# EAGLE schematic C64 (EAGLE 8.1.1)
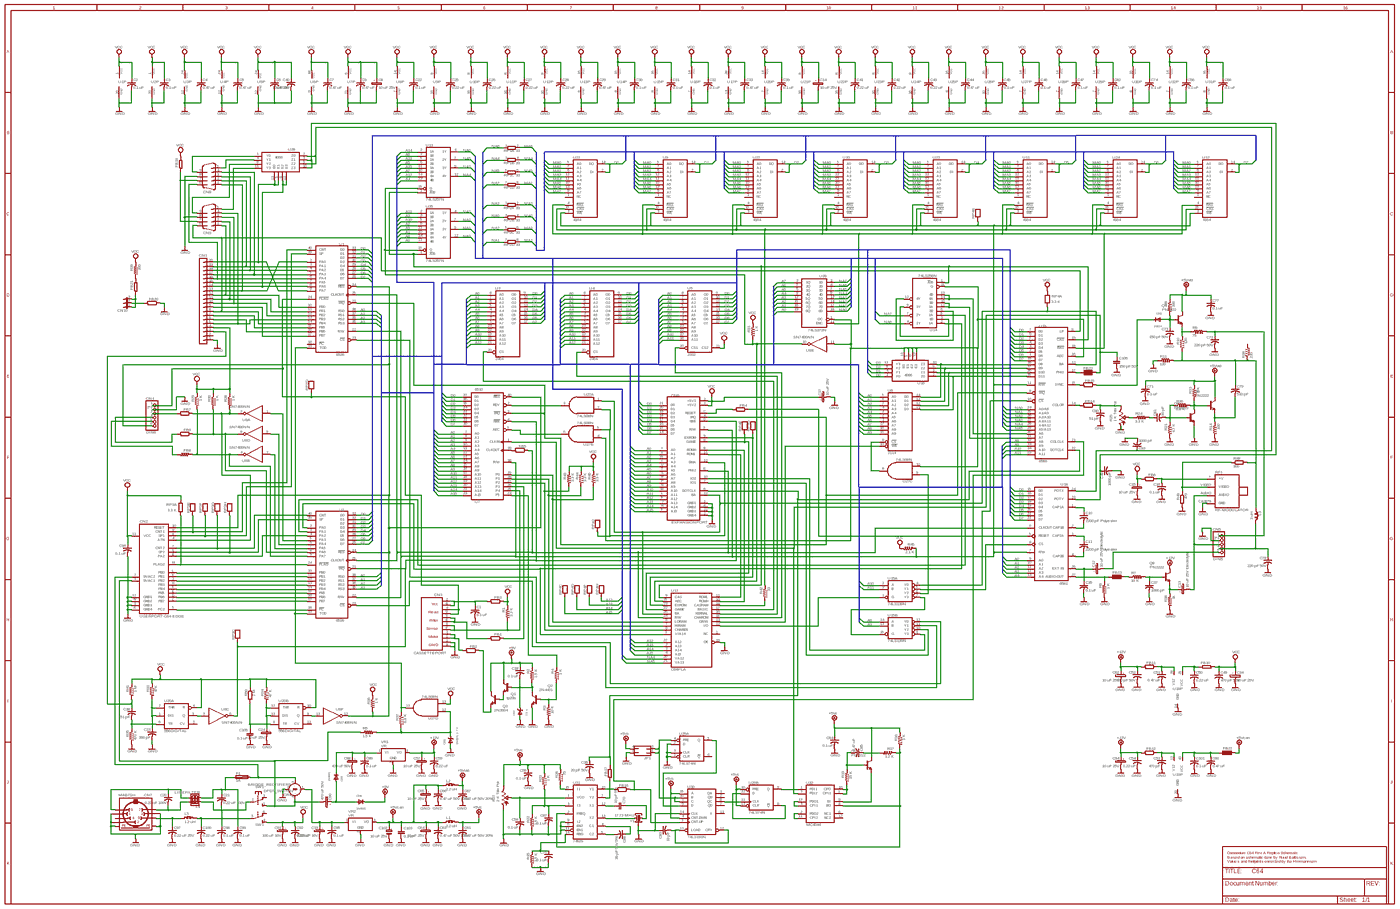
[diagram p0: schematic, sheet 1, overview]
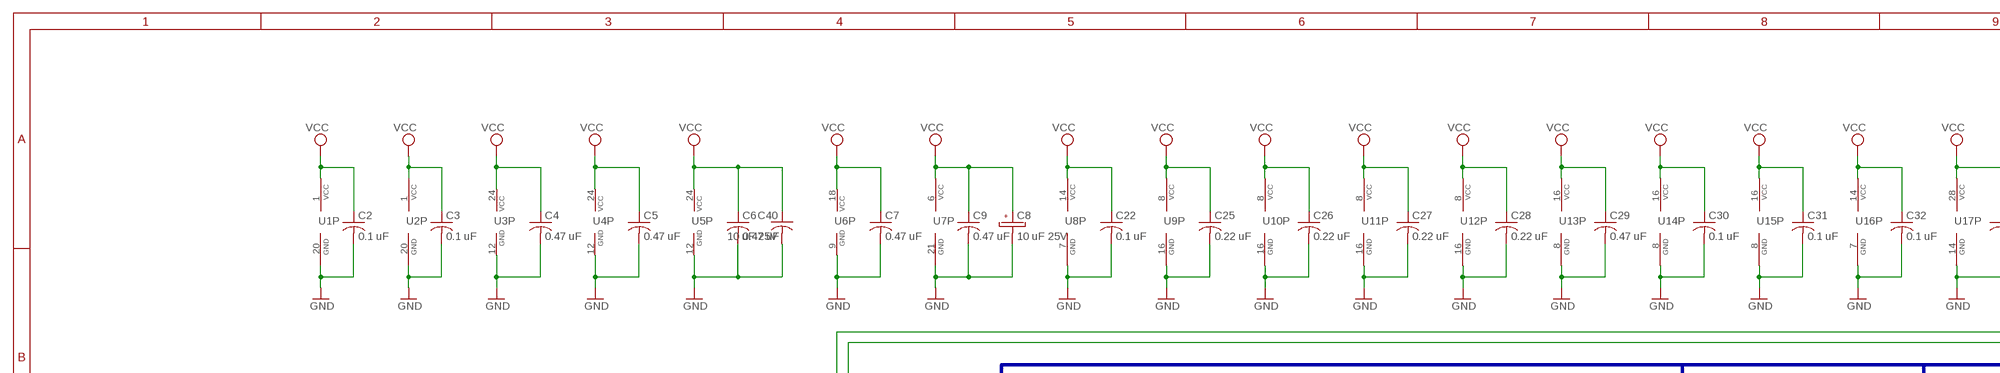
[diagram p1: schematic, sheet 1, part 1 of 4]
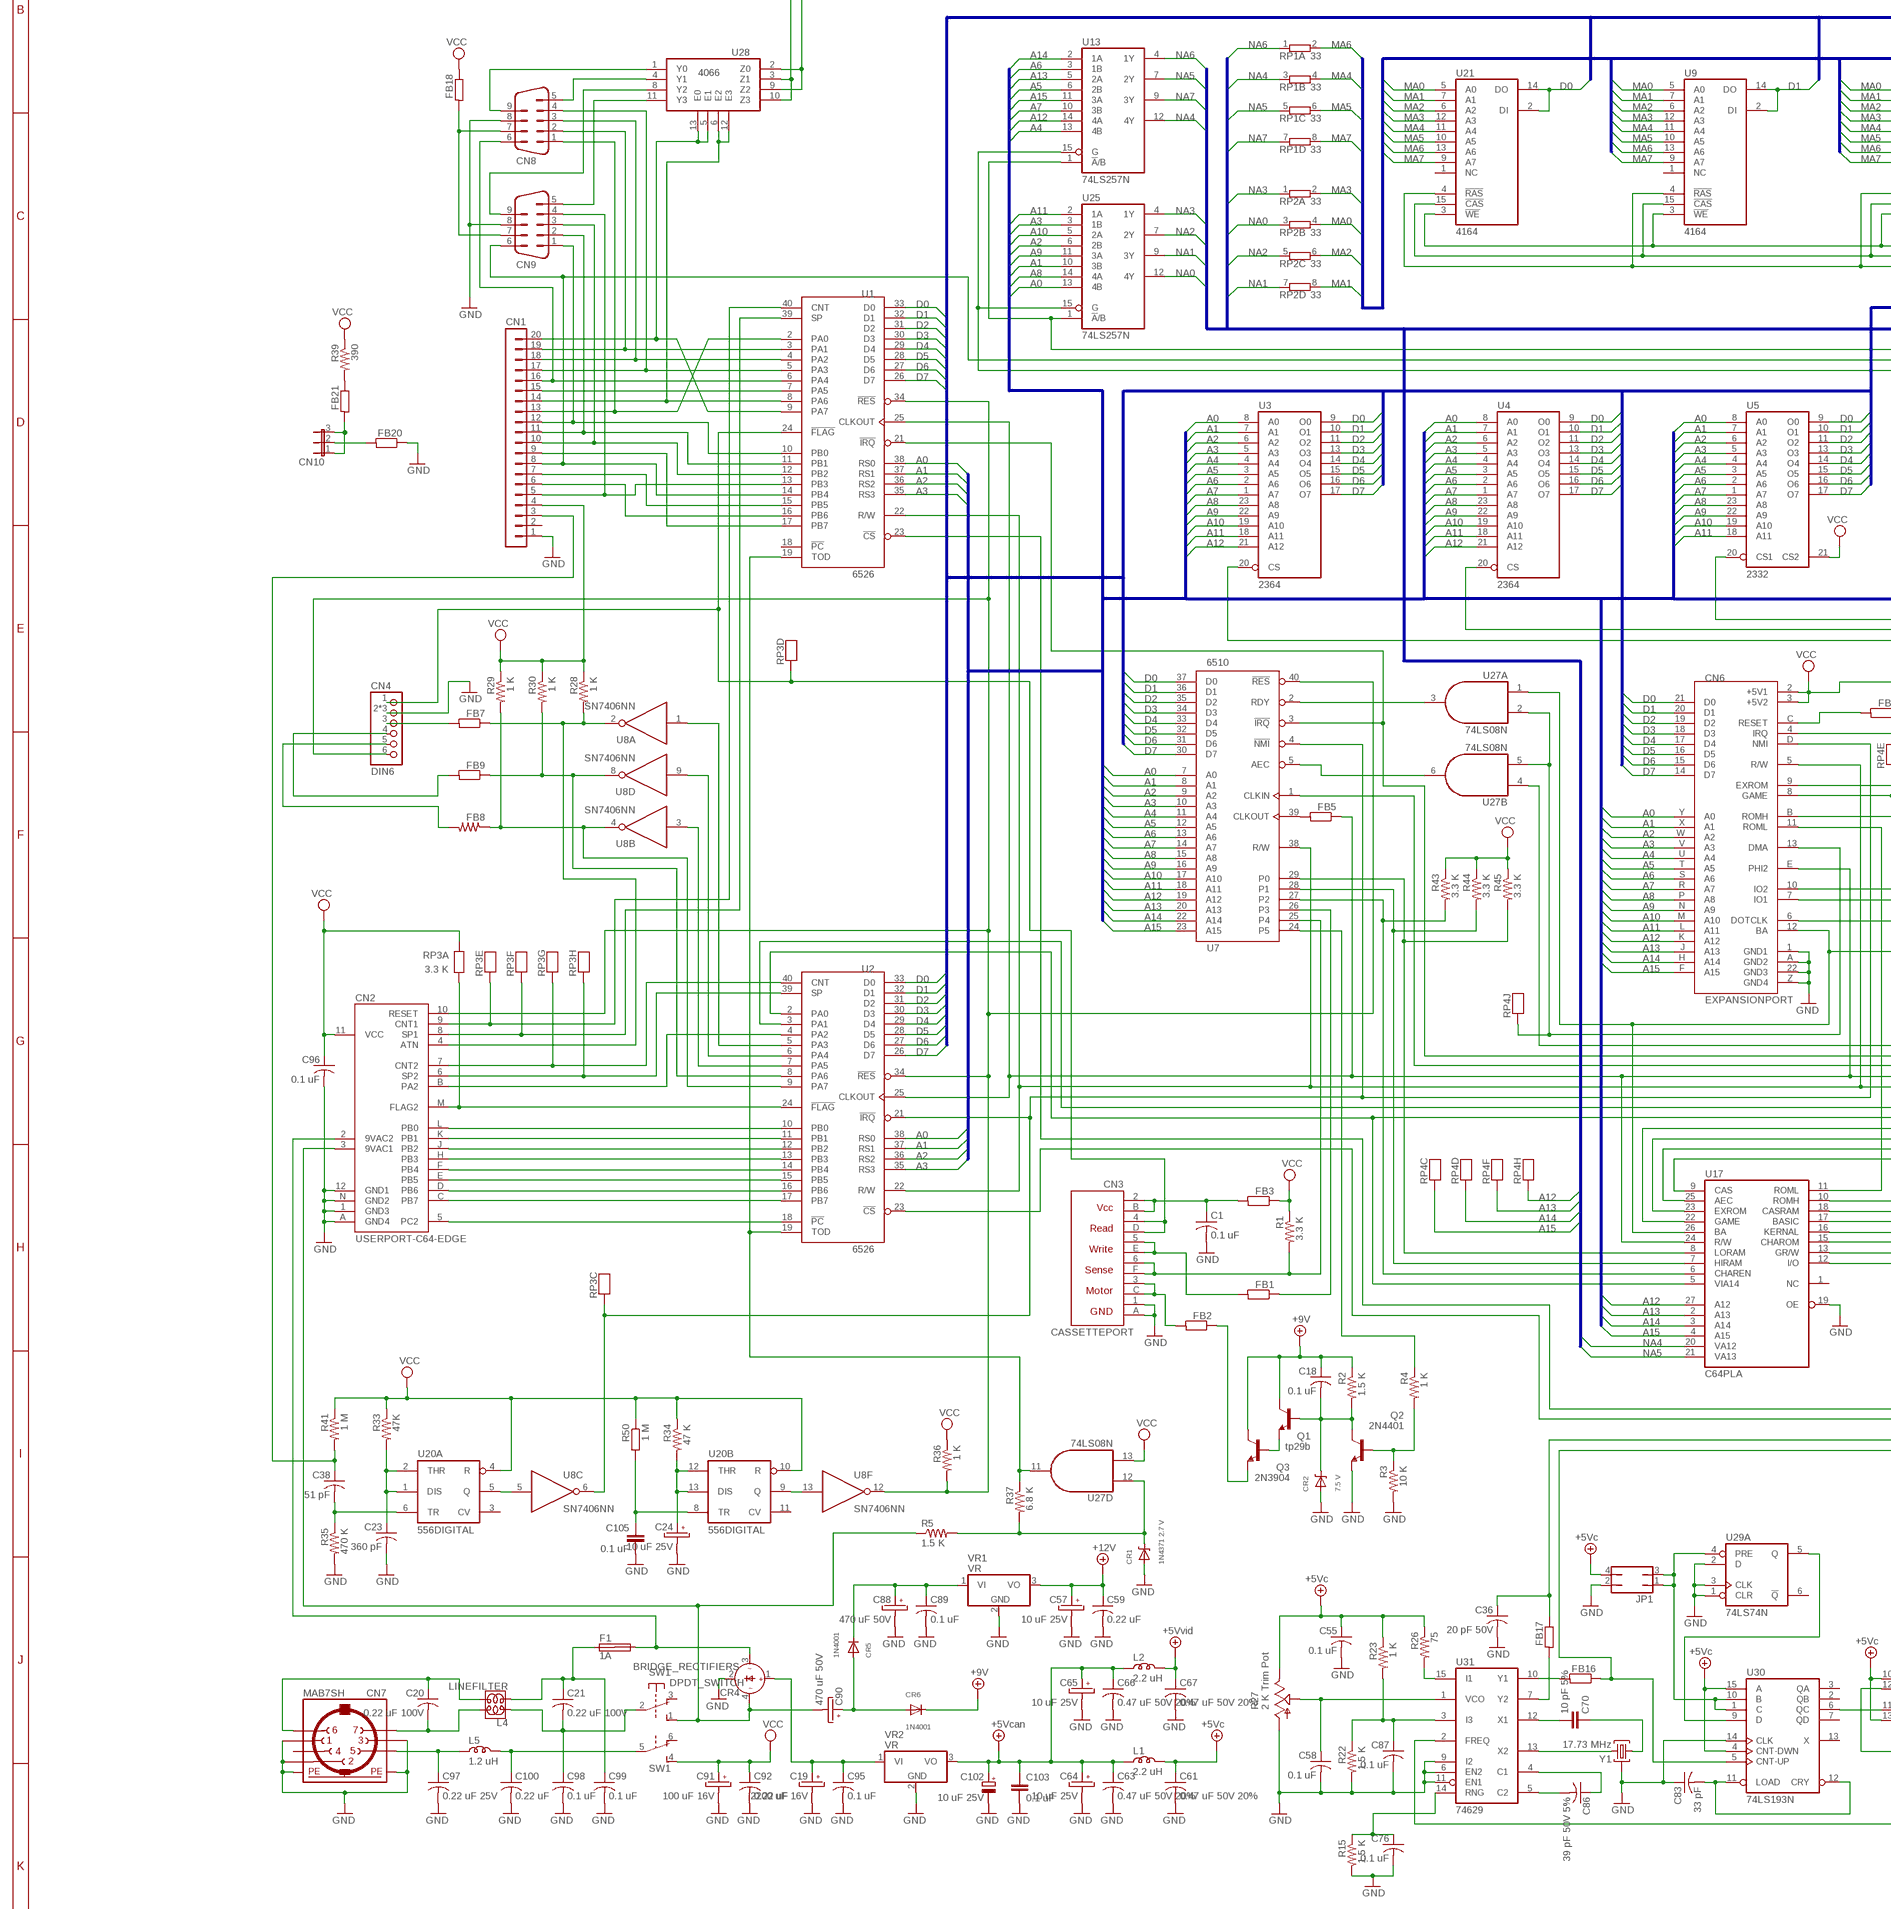
[diagram p2: schematic, sheet 1, part 2 of 4]
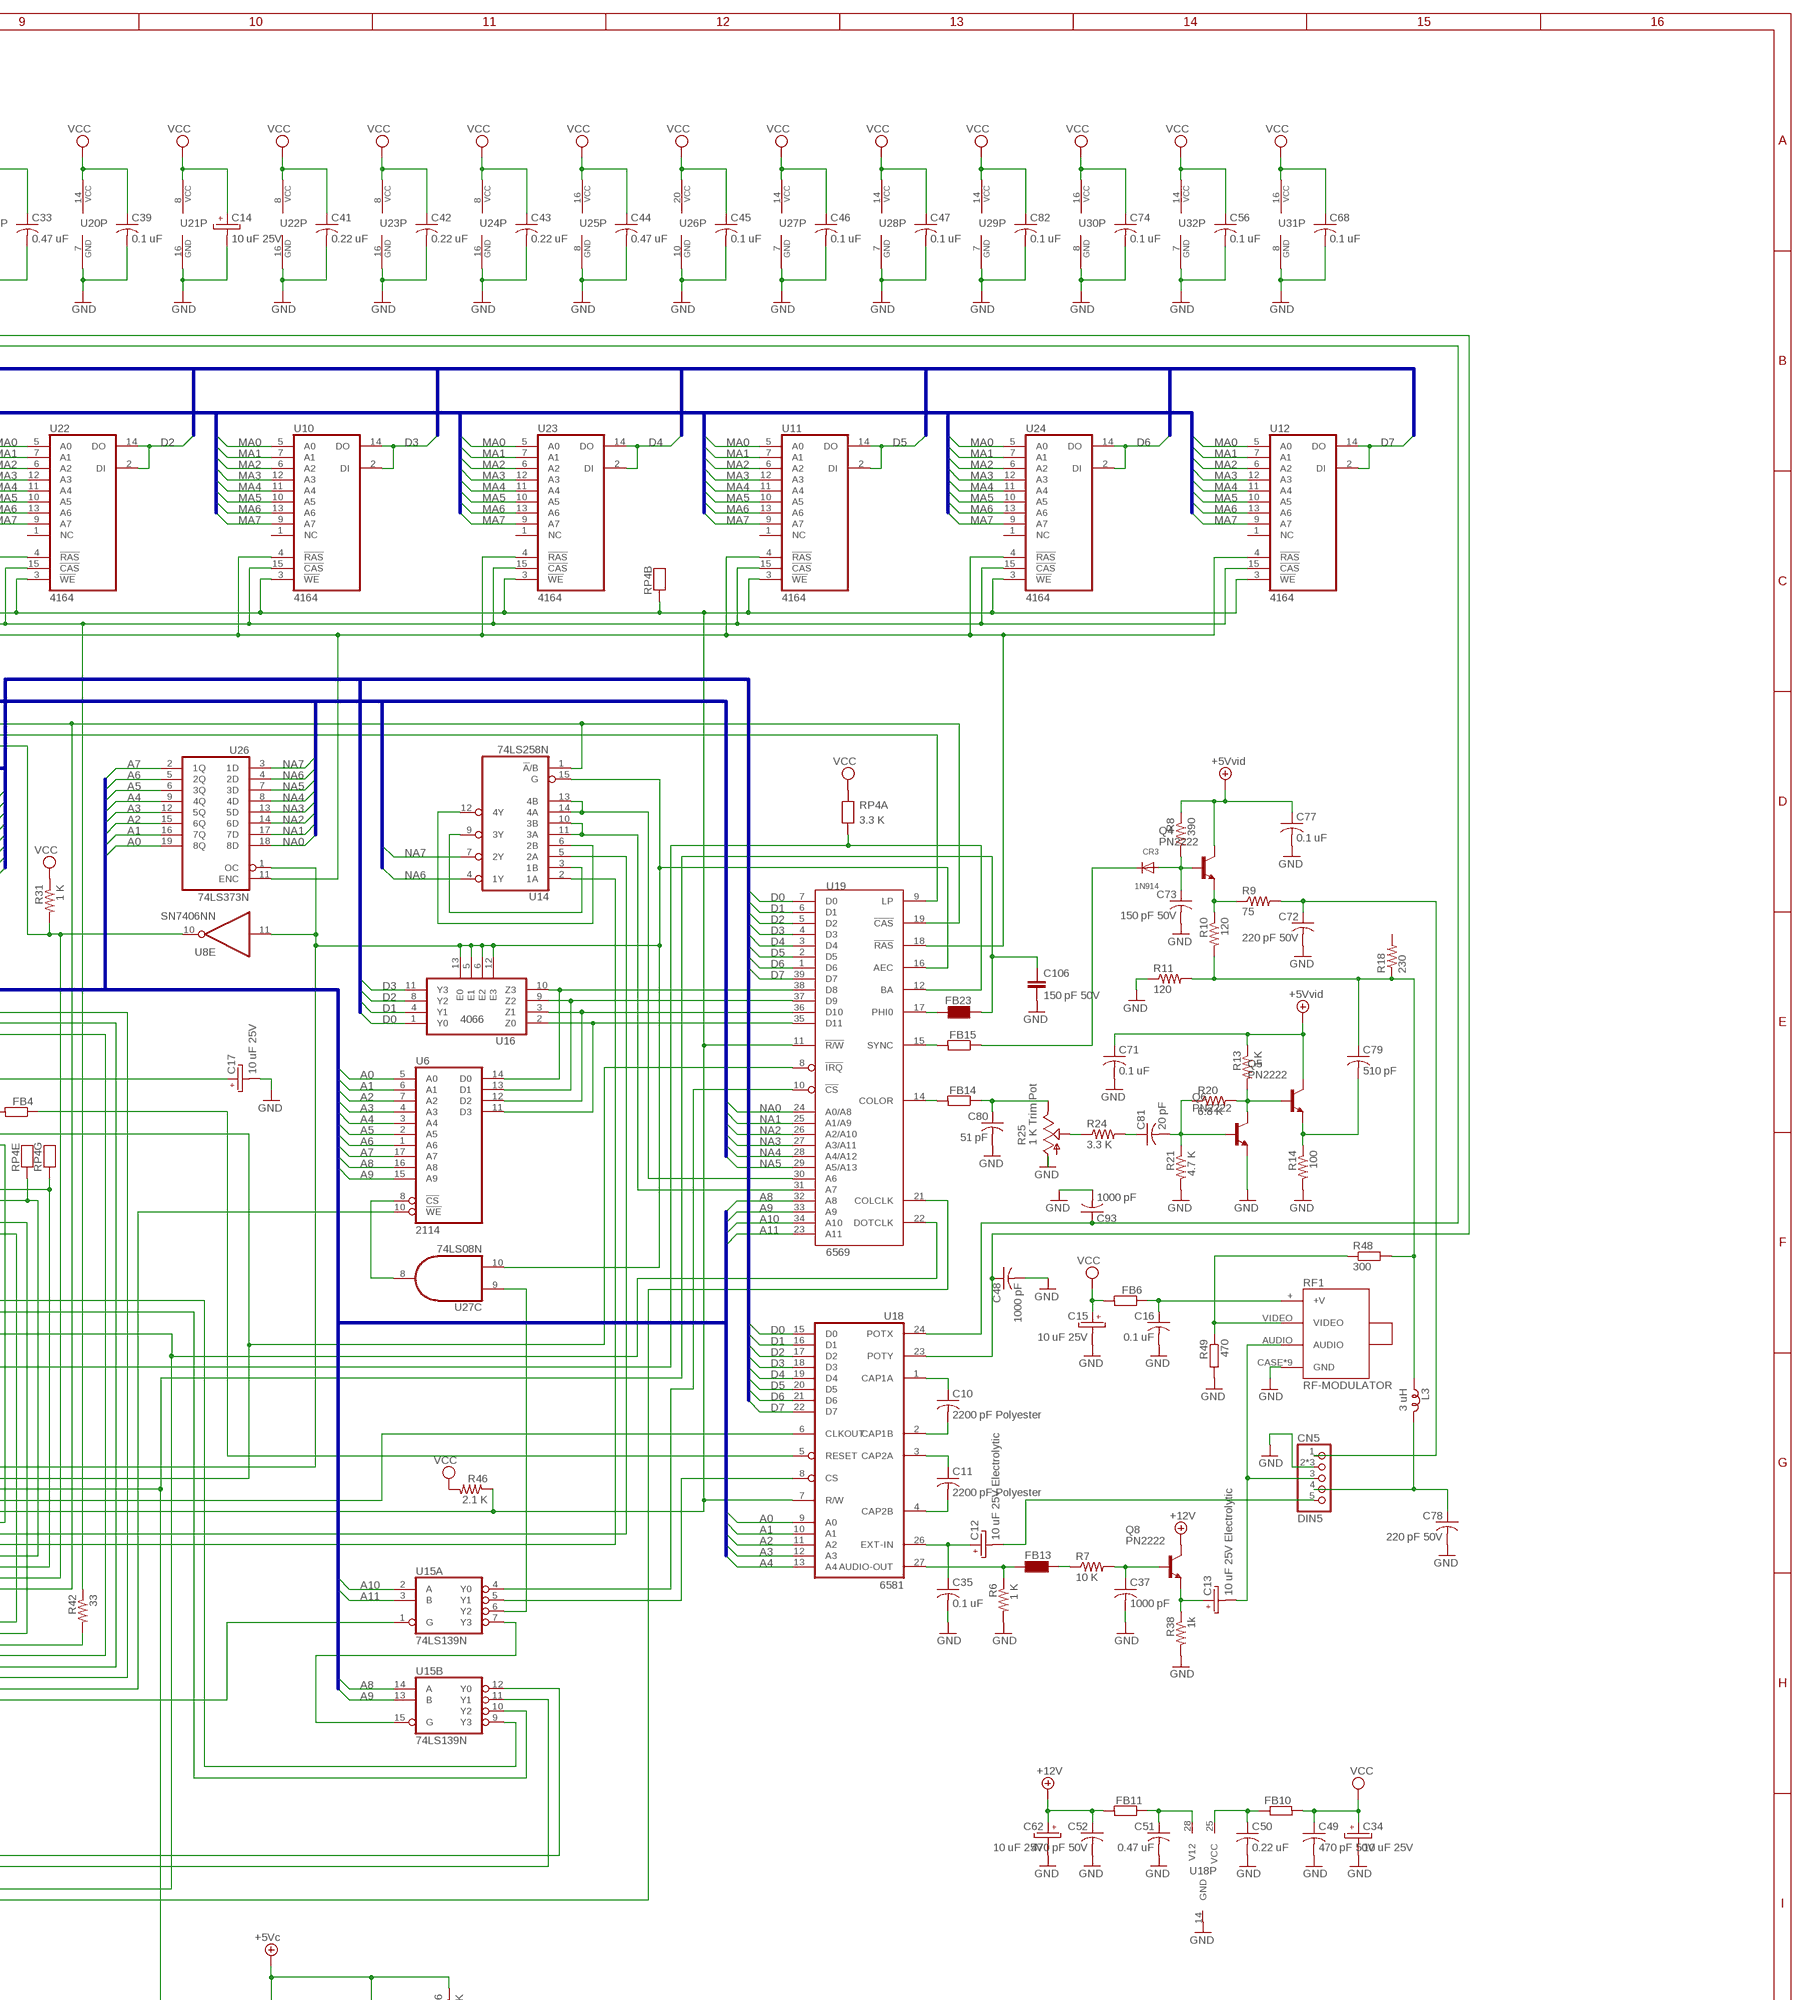
[diagram p3: schematic, sheet 1, part 3 of 4]
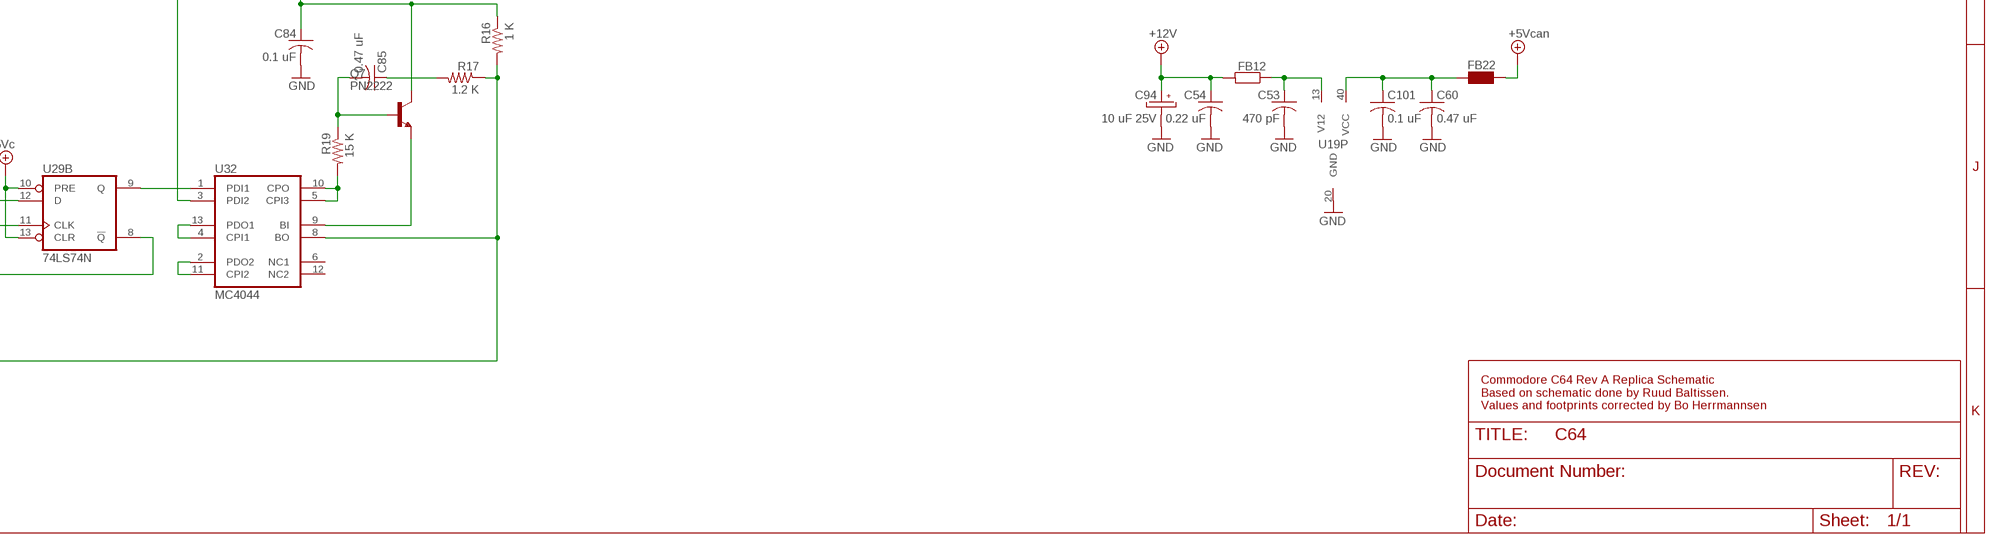
[diagram p4: schematic, sheet 1, part 4 of 4]

## Parts
C1  0.1 uF  C_0307/12C_0309/12  [0307/12]
C2  0.1 uF  C_0307/12C_0309/12  [0307/12]
C3  0.1 uF  C_0307/12C_0309/12  [0307/12]
C4  0.47 uF  C_0307/12C_0309/12  [0307/12]
C5  0.47 uF  C_0307/12C_0309/12  [0307/12]
C6  0.47 uF  C_0307/12C_0309/12  [0307/12]
C7  0.47 uF  C_0307/12C_0309/12  [0307/12]
C8  10 uF 25V  C_E_2,5-6  [E2,5-6E]
C9  0.47 uF  C_0307/12C_0309/12  [0307/12]
C10  2200 pF Polyester  C_0307/12C_0309/12  [0307/12]
C11  2200 pF Polyester  C_0307/12C_0309/12  [0307/12]
C12  10 uF 25V Electrolytic  C_E_2,5-6  [E2,5-6E]
C13  10 uF 25V Electrolytic  C_E_2,5-6  [E2,5-6E]
C14  10 uF 25V  CAPACITOR_ELECTROLYTIC_2.5_6  [CAPACITOR_ELECTROLYTIC_2.5_6]
C15  10 uF 25V  C_E_2,5-6  [E2,5-6E]
C16  0.1 uF  C_0307/12C_0309/12  [0307/12]
C17  10 uF 25V  C_E_2,5-6  [E2,5-6E]
C18  0.1 uF  C_0307/12C_0309/12  [0307/12]
C19  2200 uF 16V  E37-31.5-17.5-E  [E37-31.5-17.5-E]
C20  0.22 uF 100V  C_0203  [0203]
C21  0.22 uF 100V  C_0203  [0203]
C22  0.1 uF  CAPACITOR_12_3_7C_0309/12  [12_3_7]
C23  360 pF  CAPACITOR_12_3_7C_0309/12  [12_3_7]
C24  10 uF 25V  CAPACITOR_ELECTROLYTIC_2.5_6  [CAPACITOR_ELECTROLYTIC_2.5_6]
C25  0.22 uF  CAPACITOR_12_3_7C_0309/12  [12_3_7]
C26  0.22 uF  CAPACITOR_12_3_7C_0309/12  [12_3_7]
C27  0.22 uF  CAPACITOR_12_3_7C_0309/12  [12_3_7]
C28  0.22 uF  CAPACITOR_12_3_7C_0309/12  [12_3_7]
C29  0.47 uF  C_0307/12C_0309/12  [0307/12]
C30  0.1 uF  C_0307/12C_0309/12  [0307/12]
C31  0.1 uF  C_0307/12C_0309/12  [0307/12]
C32  0.1 uF  C_0307/12C_0309/12  [0307/12]
C33  0.47 uF  C_0307/12C_0309/12  [0307/12]
C34  10 uF 25V  C_E_2,5-6  [E2,5-6E]
C35  0.1 uF  C_0307/12C_0309/12  [0307/12]
C36  20 pF 50V  CAPACITOR_12_03_07C_0309/12  [12_03_07]
C37  1000 pF  C_0307/12C_0309/12  [0307/12]
C38  51 pF  CAPACITOR_12_3_7C_0309/12  [12_3_7]
C39  0.1 uF  CAPACITOR_12_3_7C_0309/12  [12_3_7]
C40  10 uF 25V  CAPACITOR_12_3_7C_0309/12  [12_3_7]
C41  0.22 uF  CAPACITOR_12_3_7C_0309/12  [12_3_7]
C42  0.22 uF  CAPACITOR_12_3_7C_0309/12  [12_3_7]
C43  0.22 uF  CAPACITOR_12_3_7C_0309/12  [12_3_7]
C44  0.47 uF  C_0307/12C_0309/12  [0307/12]
C45  0.1 uF  C_0307/12C_0309/12  [0307/12]
C46  0.1 uF  C_0307/12C_0309/12  [0307/12]
C47  0.1 uF  C_0307/12C_0309/12  [0307/12]
C48  1000 pF  C_0307/12C_0309/12  [0307/12]
C49  470 pF 50V  C_0307/12C_0309/12  [0307/12]
C50  0.22 uF  C_0307/12C_0309/12  [0307/12]
C51  0.47 uF  C_0307/12C_0309/12  [0307/12]
C52  470 pF 50V  C_0307/12C_0309/12  [0307/12]
C53  470 pF  C_0307/12C_0309/12  [0307/12]
C54  0.22 uF  C_0307/12C_0309/12  [0307/12]
C55  0.1 uF  CAPACITOR_12_03_07C_0309/12  [12_03_07]
C56  0.1 uF  CAPACITOR_12_03_07C_0309/12  [12_03_07]
C57  10 uF 25V  C_E_2,5-6  [E2,5-6E]
C58  0.1 uF  CAPACITOR_12_03_07C_0309/12  [12_03_07]
C59  0.22 uF  C_0307/12C_0309/12  [0307/12]
C60  0.47 uF  CAPACITOR_12_03_07C_0309/12  [12_03_07]
C61  0.47 uF 50V 20%  CAPACITOR_15_04_10  [15_4_10]
C62  10 uF 25V  C_E_2,5-6  [E2,5-6E]
C63  0.47 uF 50V 20%  CAPACITOR_15_04_10  [15_4_10]
C64  10 uF 25V  CAPACITOR_ELECTROLYTIC_2.5_6  [CAPACITOR_ELECTROLYTIC_2.5_6]
C65  10 uF 25V  CAPACITOR_ELECTROLYTIC_2.5_6  [CAPACITOR_ELECTROLYTIC_2.5_6]
C66  0.47 uF 50V 20%  CAPACITOR_15_04_10  [15_4_10]
C67  0.47 uF 50V 20%  CAPACITOR_15_04_10  [15_4_10]
C68  0.1 uF  CAPACITOR_12_03_07C_0309/12  [12_03_07]
C70  10 pF 5%  C-EU075-032X103  [C075-032X103]
C71  0.1 uF  CAPACITOR_12_03_07C_0309/12  [12_03_07]
C72  220 pF 50V  CAPACITOR_12_03_07C_0309/12  [12_03_07]
C73  150 pF 50V  CAPACITOR_12_03_07C_0309/12  [12_03_07]
C74  0.1 uF  CAPACITOR_12_03_07C_0309/12  [12_03_07]
C76  0.1 uF  CAPACITOR_12_03_07C_0309/12  [12_03_07]
C77  0.1 uF  CAPACITOR_12_03_07C_0309/12  [12_03_07]
C78  220 pF 50V  CAPACITOR_12_03_07C_0309/12  [12_03_07]
C79  510 pF  CAPACITOR_12_03_07C_0309/12  [12_03_07]
C80  51 pF  CAPACITOR_12_03_07C_0309/12  [12_03_07]
C81  20 pF  CAPACITOR_12_03_07C_0309/12  [12_03_07]
C82  0.1 uF  CAPACITOR_12_03_07C_0309/12  [12_03_07]
C83  33 pF  CAPACITOR_12_03_07C_0309/12  [12_03_07]
C84  0.1 uF  CAPACITOR_12_03_07C_0309/12  [12_03_07]
C85  0.47 uF  CAPACITOR_12_03_07C_0309/12  [12_03_07]
C86  39 pF 50V 5%  CAPACITOR_12_03_07C_0309/12  [12_03_07]
C87  0.1 uF  CAPACITOR_12_03_07C_0309/12  [12_03_07]
C88  470 uF 50V  E37-31.5-17.5-E  [E37-31.5-17.5-E]
C89  0.1 uF  C_0307/12C_0309/12  [0307/12]
C90  470 uF 50V  E37-31.5-17.5-E  [E37-31.5-17.5-E]
C91  100 uF 16V  C_E_5-9  [C_E_5-9]
C92  0.22 uF  C_0307/12C_0309/12  [0307/12]
C93  1000 pF  C_0307/12C_0309/12  [0307/12]
C94  10 uF 25V  C_E_2,5-6  [E2,5-6E]
C95  0.1 uF  C_0307/12C_0309/12  [0307/12]
C96  0.1 uF  C_0307/12C_0309/12  [0307/12]
C97  0.22 uF 25V  C_0203  [0203]
C98  0.1 uF  C_0203  [0203]
C99  0.1 uF  C_0203  [0203]
C100  0.22 uF  C_0203  [0203]
C101  0.1 uF  CAPACITOR_6_03_8.5  [6_03_8.5]
C102  10 uF 25V  CPOL-EUE3.5-10  [E3,5-10]
C103  0.1 uF  C-EU075-032X103  [C075-032X103]
C105  0.1 uF  C-EU075-032X103  [C075-032X103]
C106  150 pF 50V  C-EU075-032X103  [C075-032X103]
CN1  MA20-1  [MA20-1]
CN2  USERPORT-C64-EDGE  [UPS24EDGE]
CN3  CASSETTEPORT  [CASSETTEPORT]
CN4  DIN6  [DIN6]
CN5  DIN5  [DIN5]
CN6  EXPANSIONPORT  EXPANSIONPORT-C64  [EXPANSIONPORT]
CN7  MAB7SH  [MAB7SH]
CN8  CONTROL_PORT  [CONTROL_PORT]
CN9  CONTROL_PORT  [CONTROL_PORT]
CN10  JP2E  [JP2]
CR1  1N4371 2.7 V  ZD_0307/12  [D_0307/12]
CR2  7.5 V  ZD_0307/12  [D_0307/12]
CR3  1N914  D_0307/12  [D_0307/12]
CR4  BRIDGE_RECTIFIERS  [DIL4]
CR5  1N4001  D_0307/12  [D_0307/12]
CR6  1N4001  D_0307/12  [D_0307/12]
F1  1A  SH32  [SH32]
FB1  FB_0307/12R_0307/12  [12_03_07]
FB2  FB_0307/12R_0307/12  [12_03_07]
FB3  FB_0307/12R_0307/12  [12_03_07]
FB4  FB_0307/12R_0307/12  [12_03_07]
FB5  FB_0307/12R_0307/12  [12_03_07]
FB6  FB_0307/12R_0307/12  [12_03_07]
FB7  FERRITE_BEAD_12_3_7R_0307/12  [12_3_7]
FB8  RESISTOR_12_3_7R_0307/12  [12_3_7]
FB9  FERRITE_BEAD_12_3_7R_0307/12  [12_3_7]
FB10  FB_0307/12R_0307/12  [12_03_07]
FB11  FB_0307/12R_0307/12  [12_03_07]
FB12  FB_0307/12R_0307/12  [12_03_07]
FB13  FERRIT  [R5]
FB14  FB_0307/12R_0307/12  [12_03_07]
FB15  FB_0307/12R_0307/12  [12_03_07]
FB16  FB_0307/12R_0307/12  [12_03_07]
FB17  FB_0307/12R_0307/12  [12_03_07]
FB18  FB_0307/12R_0307/12  [12_03_07]
FB20  FB_0307/12R_0307/12  [12_03_07]
FB21  FB_0307/12R_0307/12  [12_03_07]
FB22  FERRIT  [R5]
FB23  FERRIT  [R5]
JP1  JP2Q  [JP2Q]
L1  2.2 uH  INDUCTOR_12_3_7  [12_3_7]
L2  2.2 uH  INDUCTOR_12_3_7  [12_3_7]
L3  3 uH  INDUCTOR_12_3_7  [12_3_7]
L4  LINEFILTER  [LINEFILTER]
L5  1.2 uH  COIL  [R5]
Q1  tp29b  TIP29B  [TO220V]
Q2  2N4401  [TO92]
Q3  2N3904  [TO92]
Q4  PN2222  [TO92]
Q5  PN2222  [TO92]
Q6  PN2222  [TO92]
Q7  PN2222  [TO92]
Q8  PN2222  [TO92]
R1  3.3 K  R_0307/12R_0307/12  [0307/12]
R2  1.5 K  R_0307/12R_0307/12  [0307/12]
R3  10 K  R_0307/12R_0307/12  [0307/12]
R4  1 K  R_0307/12R_0307/12  [0307/12]
R5  1.5 K  R_0307/12R_0307/12  [0307/12]
R6  1 K  R_0307/12R_0307/12  [0307/12]
R7  10 K  R_0307/12R_0307/12  [0307/12]
R8  390  RESISTOR_12_03_07R_0307/12  [12_03_07]
R9  75  RESISTOR_12_03_07R_0307/12  [12_03_07]
R10  120  RESISTOR_12_03_07R_0307/12  [12_03_07]
R11  120  RESISTOR_12_03_07R_0307/12  [12_03_07]
R13  1 K  RESISTOR_12_03_07R_0307/12  [12_03_07]
R14  100  RESISTOR_12_03_07R_0307/12  [12_03_07]
R15  1.5 K  RESISTOR_12_03_07R_0307/12  [12_03_07]
R16  1 K  RESISTOR_12_03_07R_0307/12  [12_03_07]
R17  1.2 K  RESISTOR_12_03_07R_0307/12  [12_03_07]
R18  230  RESISTOR_12_03_07R_0307/12  [12_03_07]
R19  15 K  RESISTOR_12_03_07R_0307/12  [12_03_07]
R20  6.8 K  RESISTOR_12_03_07R_0307/12  [12_03_07]
R21  4.7 K  RESISTOR_12_03_07R_0307/12  [12_03_07]
R22  1.5 K  RESISTOR_12_03_07R_0307/12  [12_03_07]
R23  1 K  RESISTOR_12_03_07R_0307/12  [12_03_07]
R24  3.3 K  RESISTOR_12_03_07R_0307/12  [12_03_07]
R25  1 K Trim Pot  POT_METER  [POT_METER]
R26  75  RESISTOR_12_03_07R_0307/12  [12_03_07]
R27  2 K Trim Pot  POT_METER  [POT_METER]
R28  1 K  RESISTOR_12_3_7R_0307/12  [12_3_7]
R29  1 K  RESISTOR_12_3_7R_0307/12  [12_3_7]
R30  1 K  RESISTOR_12_3_7R_0307/12  [12_3_7]
R31  1 K  RESISTOR_12_3_7R_0307/12  [12_3_7]
R33  47K  RESISTOR_12_3_7R_0307/12  [12_3_7]
R34  47 K  RESISTOR_12_3_7R_0307/12  [12_3_7]
R35  470 K  RESISTOR_12_3_7R_0307/12  [12_3_7]
R36  1 K  RESISTOR_12_3_7R_0307/12  [12_3_7]
R37  6.8 K  R_0307/12R_0307/12  [0307/12]
R38  1k  RESISTOR_12_3_7R_0307/12  [12_3_7]
R39  390  R_0307/12R_0307/12  [0307/12]
R41  1 M  R_0307/12R_0307/12  [0307/12]
R42  33  RESISTOR_12_3_7R_0307/12  [12_3_7]
R43  3.3 K  R_0307/12R_0307/12  [0307/12]
R44  3.3 K  R_0307/12R_0307/12  [0307/12]
R45  3.3 K  R_0307/12R_0307/12  [0307/12]
R46  2.1 K  R_0307/12R_0307/12  [0307/12]
R48  300  R-EU_0204/2V  [0204V]
R49  470  R-EU_0204/2V  [0204V]
R50  1 M  R-EU_0204/2V  [0204V]
RF1  RF-MODULATOR  [RF-MODULATOR]
RP1  33  RESISTOR_PACK_4  [RESISTOR_PACK_4]
RP2  33  RESISTOR_PACK_4  [RESISTOR_PACK_4]
RP3  3.3 K  RP8  [RP8]
RP4  3.3 K  RP9  [RP9]
SW1  DPDT_SWITCH  [DPDT_SWITCH]
U1  6526  [DIP40]
U2  6526  [DIP40]
U3  2364  [DIL24]
U4  2364  [DIL24]
U5  2332  [DIL24]
U6  2114  [DIL18]
U7  6510  [DIP40]
U8  SN7406NN  [DIL14]
U9  4164  [DIL16]
U10  4164  [DIL16]
U11  4164  [DIL16]
U12  4164  [DIL16]
U13  74LS257N  [DIL16@1]
U14  74LS258N  [DIL16@1]
U15  74LS139N  [DIL16@1]
U16  4066  [DIL14@1]
U17  C64PLA  [DIL28]
U18  6581  [DIL28]
U19  6569  [DIP40]
U20  556DIGITAL  [DIL14]
U21  4164  [DIL16]
U22  4164  [DIL16]
U23  4164  [DIL16]
U24  4164  [DIL16]
U25  74LS257N  [DIL16@1]
U26  74LS373N  [DIL20]
U27  74LS08N  [DIL14@1]
U28  4066  [DIL14@1]
U29  74LS74N  [DIL14@1]
U30  74LS193N  [DIL16@1]
U31  74629  [DIL16@1]
U32  MC4044  [DIL14@1]
VR1  VR  [TO220V]
VR2  VR  [TO220V]
Y1  17.73 MHz  HC49TL-H  [HC49TL-H]

## Nets
+5V: C63.1 C64.+ C65.+ C66.1 C102.+ C103.1 FB22.2 L1.1 L2.1 VR2.3(VO) ; supply symbol labelled +5Vcan
+5V/1: C67.1 C71.1 C77.1 L2.2 Q4.1(C) Q5.1(C) R8.1 R13.1 ; supply symbol labelled +5Vvid
+5V/2: C55.1 C61.1 C84.1 JP1.4 L1.2 Q7.1(C) R16.1 R23.1 R26.1 R27.E U29.10(B:PRE) U29.13(B:CLR) U30.4(CNT-DWN) U30.15(A) ; supply symbol labelled +5Vc
+9V: C18.1 CR6.2(C) Q1.2(C) Q3.3(C) R2.1
+12V: C52.1 C54.1 C57.+ C59.1 C62.+ C94.+ FB11.2 FB12.2 Q8.1(C) VR1.3(VO)
A0: CN6.Y(A0) U1.38(RS0) U2.38(RS0) U3.8(A0) U4.8(A0) U5.8(A0) U6.5(A0) U7.7(A0) U18.9(A0) U25.13(4B) U26.19(8Q)
A1: CN6.X(A1) U1.37(RS1) U2.37(RS1) U3.7(A1) U4.7(A1) U5.7(A1) U6.6(A1) U7.8(A1) U18.10(A1) U25.10(3B) U26.16(7Q)
A2: CN6.W(A2) U1.36(RS2) U2.36(RS2) U3.6(A2) U4.6(A2) U5.6(A2) U6.7(A2) U7.9(A2) U18.11(A2) U25.6(2B) U26.15(6Q)
A3: CN6.V(A3) U1.35(RS3) U2.35(RS3) U3.5(A3) U4.5(A3) U5.5(A3) U6.4(A3) U7.10(A3) U18.12(A3) U25.3(1B) U26.12(5Q)
A4: CN6.U(A4) U3.4(A4) U4.4(A4) U5.4(A4) U6.3(A4) U7.11(A4) U13.13(4B) U18.13(A4) U26.9(4Q)
A5: CN6.T(A5) U3.3(A5) U4.3(A5) U5.3(A5) U6.2(A5) U7.12(A5) U13.6(2B) U26.6(3Q)
A6: CN6.S(A6) U3.2(A6) U4.2(A6) U5.2(A6) U6.1(A6) U7.13(A6) U13.3(1B) U26.5(2Q)
A7: CN6.R(A7) U3.1(A7) U4.1(A7) U5.1(A7) U6.17(A7) U7.14(A7) U13.10(3B) U26.2(1Q)
A8: CN6.P(A8) U3.23(A8) U4.23(A8) U5.23(A8) U6.16(A8) U7.15(A8) U15.14(B:A) U19.32(A8) U25.14(4A)
A9: CN6.N(A9) U3.22(A9) U4.22(A9) U5.22(A9) U6.15(A9) U7.16(A9) U15.13(B:B) U19.33(A9) U25.11(3A)
A10: CN6.M(A10) U3.19(A10) U4.19(A10) U5.19(A10) U7.17(A10) U15.2(A:A) U19.34(A10) U25.5(2A)
A11: CN6.L(A11) U3.18(A11) U4.18(A11) U5.18(A11) U7.18(A11) U15.3(A:B) U19.23(A11) U25.2(1A)
A12: CN6.K(A12) RP4.9(H:X) U3.21(A12) U4.21(A12) U7.19(A12) U13.14(4A) U17.27(A12)
A13: CN6.J(A13) RP4.7(F:X) U7.20(A13) U13.5(2A) U17.2(A13)
A14: CN6.H(A14) RP4.5(D:X) U7.22(A14) U13.2(1A) U17.3(A14)
A15: CN6.F(A15) RP4.4(C:X) U7.23(A15) U13.11(3A) U17.4(A15)
D0: CN6.21(D0) U1.33(D0) U2.33(D0) U3.9(O0) U4.9(O0) U5.9(O0) U7.37(D0) U16.1(Y0) U18.15(D0) U19.7(D0) U21.2(DI) U21.14(DO)
D1: CN6.20(D1) U1.32(D1) U2.32(D1) U3.10(O1) U4.10(O1) U5.10(O1) U7.36(D1) U9.2(DI) U9.14(DO) U16.4(Y1) U18.16(D1) U19.6(D1)
D2: CN6.19(D2) U1.31(D2) U2.31(D2) U3.11(O2) U4.11(O2) U5.11(O2) U7.35(D2) U16.8(Y2) U18.17(D2) U19.5(D2) U22.2(DI) U22.14(DO)
D3: CN6.18(D3) U1.30(D3) U2.30(D3) U3.13(O3) U4.13(O3) U5.13(O3) U7.34(D3) U10.2(DI) U10.14(DO) U16.11(Y3) U18.18(D3) U19.4(D3)
D4: CN6.17(D4) U1.29(D4) U2.29(D4) U3.14(O4) U4.14(O4) U5.14(O4) U7.33(D4) U18.19(D4) U19.3(D4) U23.2(DI) U23.14(DO)
D5: CN6.16(D5) U1.28(D5) U2.28(D5) U3.15(O5) U4.15(O5) U5.15(O5) U7.32(D5) U11.2(DI) U11.14(DO) U18.20(D5) U19.2(D5)
D6: CN6.15(D6) U1.27(D6) U2.27(D6) U3.16(O6) U4.16(O6) U5.16(O6) U7.31(D6) U18.21(D6) U19.1(D6) U24.2(DI) U24.14(DO)
D7: CN6.14(D7) U1.26(D7) U2.26(D7) U3.17(O7) U4.17(O7) U5.17(O7) U7.30(D7) U12.2(DI) U12.14(DO) U18.22(D7) U19.39(D7)
GND: C1.2 C2.2 C3.2 C4.2 C5.2 C6.2 C7.2 C8.- C9.2 C14.- C15.- C16.2 C17.- C19.- C22.2 C23.2 C24.- C25.2 C26.2 C27.2 C28.2 C29.2 C30.2 C31.2 C32.2 C33.2 C34.- C35.2 C36.2 C37.2 C39.2 C40.2 C41.2 C42.2 C43.2 C44.2 C45.2 C46.2 C47.2 C48.2 C49.2 C50.2 C51.2 C52.2 C53.2 C54.2 C55.2 C56.2 C57.- C58.2 C59.2 C60.2 C61.2 C62.- C63.2 C64.- C65.- C66.2 C67.2 C68.2 C71.2 C72.2 C73.2 C74.2 C76.2 C77.2 C78.2 C80.2 C82.2 C83.1 C84.2 C87.2 C88.- C89.2 C91.- C92.2 C93.2 C94.- C95.2 C96.2 C97.2 C98.2 C99.2 C100.2 C101.2 C102.- C103.2 C105.2 C106.2 CN1.1 CN2.1(GND3) CN2.12(GND1) CN2.A(GND4) CN2.N(GND2) CN3.1(GND1) CN3.A(GND2) CN4.2 CN4.PE CN4.PE@ CN5.2 CN5.PE CN5.PE@ CN6.1(GND1) CN6.22(GND3) CN6.A(GND2) CN6.Z(GND4) CN7.1 CN7.2 CN7.3 CN7.PE CN7.PE@(PE) CN8.8 CN9.8 CR1.1(A) CR2.1(A) CR4.2(-) FB20.1 JP1.2 Q2.1(E) Q6.3(E) R3.2 R6.2 R11.1 R14.2 R15.2 R21.2 R22.2 R25.A R27.A R35.2 R38.2 R49.2 RF1.CASE(GND) RF1.P$1(GND) RF1.P$2(GND) RF1.P$3(GND) RF1.P$4(GND) RF1.P$5(GND) RF1.P$6(GND) RF1.P$7(GND) RF1.P$8(GND) U1.20(GND) U2.20(GND) U3.12(GND) U4.12(GND) U5.12(GND) U6.9(GND) U7.21(GND) U8.7(P:GND) U9.16(GND) U10.16(GND) U11.16(GND) U12.16(GND) U13.8(GND) U14.8(GND) U15.8(P:GND) U16.7(GND) U17.14(GND) U17.19(OE) U18.14(GND) U19.20(GND) U20.7(P:GND) U21.16(GND) U22.16(GND) U23.16(GND) U24.16(GND) U25.8(GND) U26.10(GND) U27.7(P:GND) U28.7(GND) U29.1(A:CLR) U29.2(A:D) U29.3(A:CLK) U29.7(P:GND) U30.8(GND) U30.14(CLK) U31.6(EN2) U31.8(GND) U31.9(I2) U31.11(EN1) U32.7(GND) VR1.2(GND) VR2.2(GND) Y1.3
IRQ: CN6.4(IRQ) U1.21(!IRQ!) U7.3(!IRQ!) U19.8(!IRQ!)
MA0: RP2.4 U9.5(A0) U10.5(A0) U11.5(A0) U12.5(A0) U21.5(A0) U22.5(A0) U23.5(A0) U24.5(A0)
MA1: RP2.8 U9.7(A1) U10.7(A1) U11.7(A1) U12.7(A1) U21.7(A1) U22.7(A1) U23.7(A1) U24.7(A1)
MA2: RP2.6 U9.6(A2) U10.6(A2) U11.6(A2) U12.6(A2) U21.6(A2) U22.6(A2) U23.6(A2) U24.6(A2)
MA3: RP2.2 U9.12(A3) U10.12(A3) U11.12(A3) U12.12(A3) U21.12(A3) U22.12(A3) U23.12(A3) U24.12(A3)
MA4: RP1.4 U9.11(A4) U10.11(A4) U11.11(A4) U12.11(A4) U21.11(A4) U22.11(A4) U23.11(A4) U24.11(A4)
MA5: RP1.6 U9.10(A5) U10.10(A5) U11.10(A5) U12.10(A5) U21.10(A5) U22.10(A5) U23.10(A5) U24.10(A5)
MA6: RP1.2 U9.13(A6) U10.13(A6) U11.13(A6) U12.13(A6) U21.13(A6) U22.13(A6) U23.13(A6) U24.13(A6)
MA7: RP1.8 U9.9(A7) U10.9(A7) U11.9(A7) U12.9(A7) U21.9(A7) U22.9(A7) U23.9(A7) U24.9(A7)
N$1: C12.+ C35.1 U18.26(EXT-IN)
N$2: FB13.1 R6.1 U18.27(AUDIO-OUT)
N$3: FB13.2 R7.1
N$4: C37.1 Q8.2(B) R7.2
N$5: C13.+ Q8.3(E) R38.1
N$6: C10.2 U18.2(CAP1B)
N$7: C11.2 U18.4(CAP2B)
N$8: C10.1 U18.1(CAP1A)
N$9: C11.1 U18.3(CAP2A)
N$10: C13.- CN5.3 RF1.AUDIO
N$11: C12.- CN5.5
N$12: C50.1 FB10.1 U18.25(VCC)
N$13: C16.1 FB6.1 RF1.+(+V)
N$14: C51.1 FB11.1 U18.28(V12)
N$15: C80.1 FB14.1 R25.E
N$16: FB14.2 U19.14(COLOR)
N$17: C97.1 CN7.5 L5.1
N$18: C100.1 L5.2 SW1.5(2:P)
N$19: C20.2 CN7.7 L4.4
N$20: C20.1 CN7.6 L4.3
N$21: C21.1 C99.1 F1.1A L4.2
N$22: C21.2 C98.1 L4.1 SW1.2(1:P)
N$23: CN2.2(9VAC2) CR4.3(AC1) F1.2A
N$24: C90.- CN2.3(9VAC1) CR4.4(AC2) R5.1 SW1.1(1:S)
N$25: C19.+ C95.1 CR4.1(+) VR2.1(VI)
N$26: C90.+ CR5.1(A) CR6.1(A)
N$27: C88.+ C89.1 CR5.2(C) VR1.1(VI)
N$28: R24.1 R25.S
N$29: C81.1 R24.2
N$30: C81.2 Q6.2(B) R20.1 R21.1
N$31: Q5.2(B) Q6.1(C) R13.2 R20.2
N$32: C79.2 Q5.3(E) R14.1
N$33: C79.1 L3.1 R10.2 R11.2 R18.1 R48.2
N$34: C60.1 C101.1 FB22.1 U19.40(VCC)
N$35: C53.1 FB12.1 U19.13(V12)
N$36: C73.1 CR3.1(A) Q4.2(B) R8.2
N$37: CR3.2(C) FB15.1
N$38: Q4.3(E) R9.1 R10.1
N$39: C72.1 CN5.1 R9.2
N$40: FB15.2 U19.15(SYNC)
N$41: C78.1 CN5.4 L3.2
N$42: U14.10(3B) U14.11(3A) U19.31(A7)
N$43: R48.1 R49.1 RF1.VIDEO
N$44: U14.13(4B) U14.14(4A) U19.30(A6)
N$45: U14.3(1B) U14.9(3Y)
N$46: U14.6(2B) U14.12(4Y)
N$47: U6.14(D0) U16.10(Z3) U19.38(D8)
N$48: U6.13(D1) U16.9(Z2) U19.37(D9)
N$49: U6.12(D2) U16.3(Z1) U19.36(D10)
N$50: U6.11(D3) U16.2(Z0) U19.35(D11)
N$51: R42.2 U17.18(CASRAM)
N$52: U8.11(E:I) U14.15(G) U16.5(E1) U16.6(E2) U16.12(E3) U16.13(E0) U19.16(AEC) U26.1(OC) U27.4(B:I0) U27.10(C:I1)
N$53: U13.1(!A!/B) U14.1(!A!/B) U17.9(CAS) U19.19(!CAS!) U25.1(!A!/B)
N$54: R42.1 U9.15(!CAS) U10.15(!CAS) U11.15(!CAS) U12.15(!CAS) U21.15(!CAS) U22.15(!CAS) U23.15(!CAS) U24.15(!CAS)
N$55: U9.4(!RAS) U10.4(!RAS) U11.4(!RAS) U12.4(!RAS) U19.18(!RAS!) U21.4(!RAS) U22.4(!RAS) U23.4(!RAS) U24.4(!RAS) U26.11(ENC)
N$56: U6.8(!CS) U27.8(C:O)
N$57: U8.13(F:I) U20.9(B:Q)
N$58: C24.+ R34.2 U20.12(B:THR) U20.13(B:DIS)
N$59: C105.1 R50.2 U20.8(B:TR)
N$60: U8.5(C:I) U20.5(A:Q)
N$61: C23.1 R33.2 U20.1(A:DIS) U20.2(A:THR)
N$62: C38.2 R35.1 U20.6(A:TR)
N$63: C38.1 CN1.3 R41.2
N$64: R26.2 U31.15(I1)
N$65: C58.1 R27.S U31.1(VCO)
N$66: FB16.2 U31.10(Y1)
N$67: U31.13(X2) Y1.2
N$68: C70.2 U31.12(X1)
N$69: C70.1 Y1.1
N$70: FB16.1 U19.21(COLCLK) U30.5(CNT-UP)
N$71: C83.2 U30.11(LOAD) U30.12(CRY)
N$72: JP1.1 JP1.3 U29.4(A:PRE) U30.1(C) U30.10(B)
N$73: U29.5(A:Q) U30.9(D)
N$74: R16.2 R17.1 U31.2(FREQ) U32.8(BO)
N$75: U29.11(B:CLK) U30.6(QC)
N$76: U29.8(B:!Q) U29.12(B:D)
N$77: U32.2(PDO2) U32.11(CPI2)
N$78: U32.4(CPI1) U32.13(PDO1)
N$79: C87.1 R22.1 R23.2 U31.3(I3)
N$80: C86.1 U31.4(C1)
N$81: C86.2 U31.5(C2)
N$82: FB17.2 U31.7(Y2)
N$83: U29.9(B:Q) U32.1(PDI1)
N$84: CN3.5(WRITE1) CN3.E(WRITE2) FB1.2
N$85: R19.2 U32.5(CPI3) U32.10(CPO)
N$86: C85.1 R17.2
N$87: C36.1 CN6.6(DOTCLK) FB17.1 U19.22(DOTCLK)
N$88: C85.2 Q7.2(B) R19.1
N$89: R31.2 U8.10(E:O) U13.15(G) U17.25(AEC) U25.15(G)
N$90: Q7.3(E) U32.9(BI)
N$91: CN1.19 CN8.2 U1.3(PA1)
N$92: CN1.18 CN8.3 U1.4(PA2)
N$93: CN1.17 CN8.4 U1.5(PA3)
N$94: CN1.16 CN8.6 U1.6(PA4)
N$95: CN1.15 U1.7(PA5)
N$96: CN1.14 U1.8(PA6) U28.6(E2) U28.12(E3)
N$97: CN1.20 U1.9(PA7) U28.5(E1) U28.13(E0)
N$98: CN1.13 CN8.1 U1.2(PA0)
N$99: CN1.12 CN9.1 U1.10(PB0)
N$100: CN1.11 CN9.2 U1.11(PB1)
N$101: CN1.10 CN9.3 U1.12(PB2)
N$102: CN1.9 U1.17(PB7)
N$103: CN1.8 CN9.6 U1.14(PB4) U19.9(LP)
N$104: CN1.7 U1.15(PB5)
N$105: CN1.5 CN9.4 U1.13(PB3)
N$106: CN1.6 U1.16(PB6)
N$107: CN8.9 U28.1(Y0)
N$108: CN8.5 U28.4(Y1)
N$109: CN8.7 CN9.7 FB18.2
N$110: CN9.9 U28.8(Y2)
N$111: CN9.5 U28.11(Y3)
N$112: C93.1 U18.24(POTX) U28.2(Z0) U28.9(Z2)
N$113: C48.1 U18.23(POTY) U28.3(Z1) U28.10(Z3)
N$114: CN4.3 FB7.2
N$115: CN4.4 FB9.2
N$116: CN4.5 FB8.2
N$117: FB8.1 R29.2 U2.9(PA7) U8.4(B:O)
N$118: FB9.1 R30.2 U2.8(PA6) U8.8(D:O)
N$119: CN2.4(ATN) FB7.1 R28.2 U8.2(A:O)
N$120: CN2.5(PC2) U2.18(!PC!)
N$121: CN2.C(PB7) U2.17(PB7)
N$122: CN2.D(PB6) U2.16(PB6)
N$123: CN2.E(PB5) U2.15(PB5)
N$124: CN2.F(PB4) U2.14(PB4)
N$125: CN2.H(PB3) U2.13(PB3)
N$126: CN2.J(PB2) U2.12(PB2)
N$127: CN2.K(PB1) U2.11(PB1)
N$128: CN2.L(PB0) U2.10(PB0)
N$129: CN2.M(FLAG2) RP3.2 U2.24(!FLAG!)
N$130: U2.7(PA5) U8.3(B:I)
N$131: U2.6(PA4) U8.9(D:I)
N$132: U2.5(PA3) U8.1(A:I)
N$133: CN3.3(MOTOR1) CN3.C(MOTOR2) FB2.2
N$134: CN2.9(CNT1) RP3.5(E:X) U1.40(CNT)
N$135: U2.2(PA0) U14.2(1A) U17.5(VIA14)
N$136: U2.3(PA1) U14.5(2A)
N$137: CN2.B(PA2) U2.4(PA2)
N$138: CN2.6(SP2) RP3.8(H:X) U2.39(SP)
N$139: CN2.7(CNT2) RP3.7(G:X) U2.40(CNT)
N$140: CN2.8(SP1) RP3.6(F:X) U1.39(SP)
N$141: FB5.2 U7.39(CLKOUT)
N$143: C76.1 R15.1 U31.14(RNG)
N$145: U3.20(CS) U17.17(BASIC)
N$146: CR1.2(C) R5.2 R37.2 U27.12(D:I0)
N$147: R37.1 U1.19(TOD) U2.19(TOD) U27.11(D:O)
N$148: CN10.1 CN10.3 FB21.2
N$149: CN10.2 FB20.2
N$150: FB4.1 U18.5(RESET)
N$151: FB21.1 R39.2
N$152: U4.20(CS) U17.16(KERNAL)
N$153: CN6.C(RESET) FB4.2
N$155: CN6.12(BA) RP4.2 U17.26(BA) U19.12(BA) U27.1(A:I0)
N$157: CN6.11(ROML) U17.11(ROML)
N$158: CN6.B(ROMH) U17.10(ROMH)
N$159: CN6.9(EXROM) RP4.8(G:X) U17.23(EXROM)
N$160: CN6.8(GAME) RP4.6(E:X) U17.22(GAME)
N$162: FB23.2 U19.17(PHI0)
N$163: U15.4(A:Y0) U19.10(!CS!)
N$164: R45.2 U7.29(P0) U17.8(LORAM)
N$165: R44.2 U7.28(P1) U17.7(HIRAM)
N$166: R43.2 U7.27(P2) U17.6(CHAREN)
N$167: U7.2(RDY) U27.3(A:O)
N$168: U7.5(AEC) U27.6(B:O)
N$169: CN6.13(DMA) RP4.10(J:X) U27.2(A:I1) U27.5(B:I1)
N$170: U5.20(CS1) U17.15(CHAROM)
N$171: CN3.4(READ1) CN3.D(READ2) CN4.1 RP3.4(D:X) U1.24(!FLAG!)
N$172: CN3.6(SENSE1) CN3.F(SENSE2) R1.2 U7.25(P4)
N$173: C1.1 CN3.2(VCC1) CN3.B(VCC2) FB3.2
N$176: FB1.1 U7.26(P3)
N$177: Q2.2(B) R3.1 R4.2
N$178: Q1.3(E) Q3.2(B)
N$179: C18.2 CR2.2(C) Q1.1(B) Q2.3(C) R2.2
N$180: FB2.1 Q3.1(E)
N$181: R4.1 U7.24(P5)
N$182: U1.23(!CS!) U15.12(B:Y0)
N$183: U2.23(!CS!) U15.11(B:Y1)
N$184: U6.10(!WE) U17.13(GR/W)
N$185: U15.1(A:G) U17.12(I/O)
N$186: U15.7(A:Y3) U15.15(B:G)
N$187: CN6.7(IO1) U15.10(B:Y2)
N$188: CN6.10(IO2) U15.9(B:Y3)
N$189: U15.5(A:Y1) U18.8(CS)
N$190: U15.6(A:Y2) U27.9(C:I0)
NA0: RP2.3 U19.24(A0/A8) U25.12(4Y) U26.18(8D)
NA1: RP2.7 U19.25(A1/A9) U25.9(3Y) U26.17(7D)
NA2: RP2.5 U19.26(A2/A10) U25.7(2Y) U26.14(6D)
NA3: RP2.1 U19.27(A3/A11) U25.4(1Y) U26.13(5D)
NA4: RP1.3 U13.12(4Y) U17.20(VA12) U19.28(A4/A12) U26.8(4D)
NA5: RP1.5 U13.7(2Y) U17.21(VA13) U19.29(A5/A13) U26.7(3D)
NA6: RP1.1 U13.4(1Y) U14.4(1Y) U26.4(2D)
NA7: RP1.7 U13.9(3Y) U14.7(2Y) U26.3(1D)
NMI: CN6.D(NMI) RP3.3(C:X) U2.21(!IRQ!) U7.4(!NMI!) U8.6(C:O)
PHI0: C106.1 FB23.1 U7.1(CLKIN) U32.3(PDI2)
PHI2: CN6.E(PHI2) FB5.1 U1.25(CLKOUT) U2.25(CLKOUT) U17.24(R/W) U18.6(CLKOUT)
RES: CN2.10(RESET) CN4.6 R36.2 U1.34(!RES!) U2.34(!RES!) U7.40(!RES!) U8.12(F:O)
RW: CN6.5(R/W) R46.1 RP4.3(B:X) U1.22(R/W) U2.22(R/W) U7.38(R/W) U9.3(!WE) U10.3(!WE) U11.3(!WE) U12.3(!WE) U18.7(R/W) U19.11(!R/W!) U21.3(!WE) U22.3(!WE) U23.3(!WE) U24.3(!WE)
VCC: C2.1 C3.1 C4.1 C5.1 C6.1 C7.1 C8.+ C9.1 C14.+ C15.+ C17.+ C22.1 C25.1 C26.1 C27.1 C28.1 C29.1 C30.1 C31.1 C32.1 C33.1 C34.+ C39.1 C40.1 C41.1 C42.1 C43.1 C44.1 C45.1 C46.1 C47.1 C49.1 C56.1 C68.1 C74.1 C82.1 C91.+ C92.1 C96.1 CN1.4 CN2.11(VCC) CN6.2(+5V1) CN6.3(+5V2) FB3.1 FB6.2 FB10.2 FB18.1 R1.1 R28.1 R29.1 R30.1 R31.1 R33.1 R34.1 R36.1 R39.1 R41.1 R43.1 R44.1 R45.1 R46.2 R50.1 RP3.1 RP4.1 SW1.4(2:S) U1.1(VCC) U2.1(VCC) U3.24(VCC) U4.24(VCC) U5.21(CS2) U5.24(VCC) U6.18(VCC) U7.6(VCC) U8.14(P:VCC) U9.8(VCC) U10.8(VCC) U11.8(VCC) U12.8(VCC) U13.16(VCC) U14.16(VCC) U15.16(P:VCC) U16.14(VCC) U17.28(VCC) U20.4(A:R) U20.10(B:R) U20.14(P:VCC) U21.8(VCC) U22.8(VCC) U23.8(VCC) U24.8(VCC) U25.16(VCC) U26.20(VCC) U27.13(D:I1) U27.14(P:VCC) U28.14(VCC) U29.14(P:VCC) U30.16(VCC) U31.16(VCC) U32.14(VCC)
Unconnected: CN1.2 CN7.4 F1.1B F1.2B R18.2 SW1.3(1:O) SW1.6(2:O) U1.18(!PC!) U9.1(NC) U10.1(NC) U11.1(NC) U12.1(NC) U17.1(NC) U20.3(A:CV) U20.11(B:CV) U21.1(NC) U22.1(NC) U23.1(NC) U24.1(NC) U29.6(A:!Q) U30.2(QB) U30.3(QA) U30.7(QD) U30.13(X) U32.6(NC1) U32.12(NC2)

## Buses
DATA:D[0..7]
ÀDDRESS:A[0..23]
MADDRESS:MA[0..7]
NA:NA[0..7]

## Notes on the sheet
- Commodore C64 Rev A Replica Schematic
  Based on schematic done by Ruud Baltissen.
  Values and footprints corrected by Bo Herrmannsen

## Library data of the parts
C1-C7 C9-C11 C16 C18 C29-C33 C35 C37 C44-C54 C59 C89 C92 C93 C95 C96 = 326298_rev_a:C_0307/12: Capacitor, American symbol
C8 C12 C13 C15 C17 C34 C57 C62 C94 = 326298_rev_a:C_E_2,5-6: Capacitor Electrolytic, American symbol
C14 C24 C64 C65 = 326298_rev_a:CAPACITOR_ELECTROLYTIC_2.5_6: Capacitor Electrolytic, American symbol
C19 C88 C90 = 326298_rev_a:E37-31.5-17.5-E
C20 C21 C97-C100 = 326298_rev_a:C_0203: Capacitor, American symbol
C22 C23 C25-C28 C38-C43 = 326298_rev_a:CAPACITOR_12_3_7: Capacitor, American symbol
C36 C55 C56 C58 C60 C68 C71-C74 C76-C87 = 326298_rev_a:CAPACITOR_12_03_07: Capacitor, American symbol
C61 C63 C66 C67 = 326298_rev_a:CAPACITOR_15_04_10: Capacitor, American symbol
C70 C103 C105 C106 = rcl:C-EU: CAPACITOR, European symbol
C91 = 326298_rev_a:C_E_5-9: Capacitor Electrolytic, American symbol
C101 = 326298_rev_a:CAPACITOR_6_03_8.5: Capacitor, American symbol
C102 = rcl:CPOL-EU: POLARIZED CAPACITOR, European symbol
CN1 = 326298_rev_a:MA20-1: PIN HEADER; OC_FARNELL: unknown; OC_NEWARK: unknown
CN2 = 326298_rev_a:USERPORT-C64-EDGE
CN3 = 326298_rev_a:CASSETTEPORT
CN4 = 326298_rev_a:DIN6
CN5 = 326298_rev_a:DIN5
CN6 = 326298_rev_a:EXPANSIONPORT-C64
CN7 = con-hirschmann:MAB7SH: Female CONNECTOR 7 pins with shield, horizontal (DIN 45329)
CN8 CN9 = 326298_rev_a:CONTROL_PORT: SUB-D; OC_FARNELL: unknown; OC_NEWARK: unknown
CN10 = jumper:JP2E: JUMPER
CR1 CR2 = 326298_rev_a:ZD_0307/12: Zener Diode, American symbol
CR3 CR5 CR6 = 326298_rev_a:D_0307/12: Diode, American symbol
CR4 = 326298_rev_a:BRIDGE_RECTIFIERS
F1 = 326298_rev_a:SH32: FUSE HOLDER 6 x 32 mm, SH contact, SHH3N Schukat, 102071 Wickmann (Buerklin); MPN: 10207101009; OC_FARNELL: 811786; OC_NEWARK: 76R6904
FB1-FB6 FB10-FB12 FB14-FB18 FB20 FB21 = 326298_rev_a:FB_0307/12: Ferite Bead, American symbol
FB7 FB9 = 326298_rev_a:FERRITE_BEAD_12_3_7: Ferite Bead, American symbol
FB8 R28-R31 R33-R36 R38 R42 = 326298_rev_a:RESISTOR_12_3_7: RESISTOR, American symbol
FB13 FB22 FB23 = 0RB_Passive:FERRIT
JP1 = jumper:JP2Q: JUMPER
L1-L3 = 326298_rev_a:INDUCTOR_12_3_7
L4 = 326298_rev_a:LINEFILTER
L5 = 326298_rev_a:COIL
Q1 = 326298_rev_a:TIP29B: NPN Transistor
Q2 = 326298_rev_a:2N4401: NPN Transistor
Q3 = 326298_rev_a:2N3904: NPN Transistor
Q4-Q8 = 326298_rev_a:PN2222: NPN Transistor
R1-R7 R37 R39 R41 R43-R46 = 326298_rev_a:R_0307/12: RESISTOR, American symbol
R8-R11 R13-R24 R26 = 326298_rev_a:RESISTOR_12_03_07: RESISTOR, American symbol
R25 R27 = 326298_rev_a:POT_METER
R48-R50 = rcl:R-EU_: RESISTOR, European symbol
RF1 = 326298_rev_a:RF-MODULATOR
RP1 RP2 = 326298_rev_a:RESISTOR_PACK_4: SIL RESISTOR; OC_FARNELL: unknown; OC_NEWARK: unknown
RP3 = 326298_rev_a:RP8
RP4 = 326298_rev_a:RP9
SW1 = 326298_rev_a:DPDT_SWITCH: MARQUARDT SWITCH 9077.0200 Distributor: Buerklin <https://www.buerklin.com/default.asp?event=ShowArtikel%2812G2822%29&l=d&jump=ArtNr_12G2822>
U1 U2 = 326298_rev_a:6526
U3 U4 = 326298_rev_a:2364: MEMORY
U5 = 0RB_Memory:2332: MEMORY
U6 = 326298_rev_a:2114: MEMORY
U7 = 326298_rev_a:6510: Processor used in Commodore 64 and VIC-10
U8 = 326298_rev_a:SN7406N: Hex INVERTER, open collector high-voltage output
U9-U12 U21-U24 = 326298_rev_a:4164: MEMORY
U13 U25 = 326298_rev_a:74*257: Quadruple 2-to 1 line data SELECTOR/MULTIPLEXER
U14 = 326298_rev_a:74*258: Quadruple 2-to 1 line data SELECTOR/MULTIPLEXER
U15 = 326298_rev_a:74*139: Dual 2-line to 4-line DECODER/DEMULTIPLEXER
U16 U28 = 326298_rev_a:4066; RS: 662-2735
U17 = 326298_rev_a:C64PLA: MEMORY
U18 = 326298_rev_a:6581
U19 = 326298_rev_a:6569
U20 = 326298_rev_a:556DIGITAL; RS: 102-5739
U26 = 326298_rev_a:74*373: Octal D type transparent LATCH, edge triggered
U27 = 326298_rev_a:74*08: Quad 2-input AND gate
U29 = 326298_rev_a:74*74: Dual D type positive edge triggered FLIP FLOP, preset and clear
U30 = 326298_rev_a:74*193: Synchronous UP/DOWN COUNTER
U31 = 326298_rev_a:74629
U32 = 326298_rev_a:MC4044
VR1 VR2 = 326298_rev_a:VR
Y1 = crystal:HC49TL-H: CRYSTAL